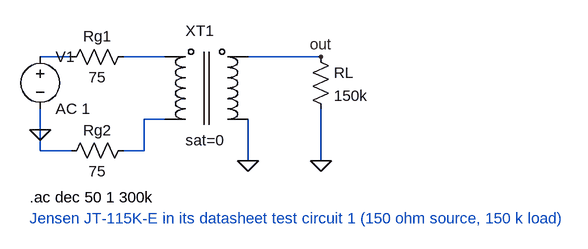
[diagram p0: schematic demo_audio-transformer.asc]
demo_audio-transformer.asc, the LTspice schematic file:
Version 4
SHEET 1 880 400
WIRE 64 96 112 96
WIRE 192 96 256 96
WIRE 384 96 496 96
WIRE 64 208 64 240
WIRE 64 240 112 240
WIRE 192 240 224 240
WIRE 224 240 224 192
WIRE 224 192 256 192
WIRE 64 176 64 208
WIRE 384 192 384 256
WIRE 496 176 496 256
FLAG 384 256 0
FLAG 496 256 0
FLAG 496 96 out
FLAG 64 208 0
SYMBOL voltage 64 80 R0
SYMATTR InstName V1
SYMATTR Value AC 1
SYMBOL res 208 80 R90
WINDOW 0 0 56 VBottom 2
WINDOW 3 32 56 VTop 2
SYMATTR InstName Rg1
SYMATTR Value 75
SYMBOL res 208 224 R90
WINDOW 0 0 56 VBottom 2
WINDOW 3 32 56 VTop 2
SYMATTR InstName Rg2
SYMATTR Value 75
SYMBOL XF_JT115KE 256 64 R0
SYMATTR InstName XT1
SYMATTR Value sat=0
SYMBOL res 480 80 R0
SYMATTR InstName RL
SYMATTR Value 150k
TEXT 48 312 Left 2 !.ac dec 50 1 300k
TEXT 48 344 Left 2 ;Jensen JT-115K-E in its datasheet test circuit 1 (150 ohm source, 150 k load)

The netlist it stands for:
* demo_audio-transformer.asc
V1 N001 0 AC 1
Rg1 N002 N001 75
Rg2 N003 0 75
XXT1 N002 N003 out 0 XF_JT115KE sat=0  ; pins P1 P2 S1 S2
RL out 0 150k
.ac dec 50 1 300k
* Jensen JT-115K-E in its datasheet test circuit 1 (150 ohm source, 150 k load)
.lib audio-transformer.sub
.backanno
.end